# EAGLE schematic 417-300-001B Main Power Enclosure (EAGLE 6.5.0)

## Sheet 1 of 3
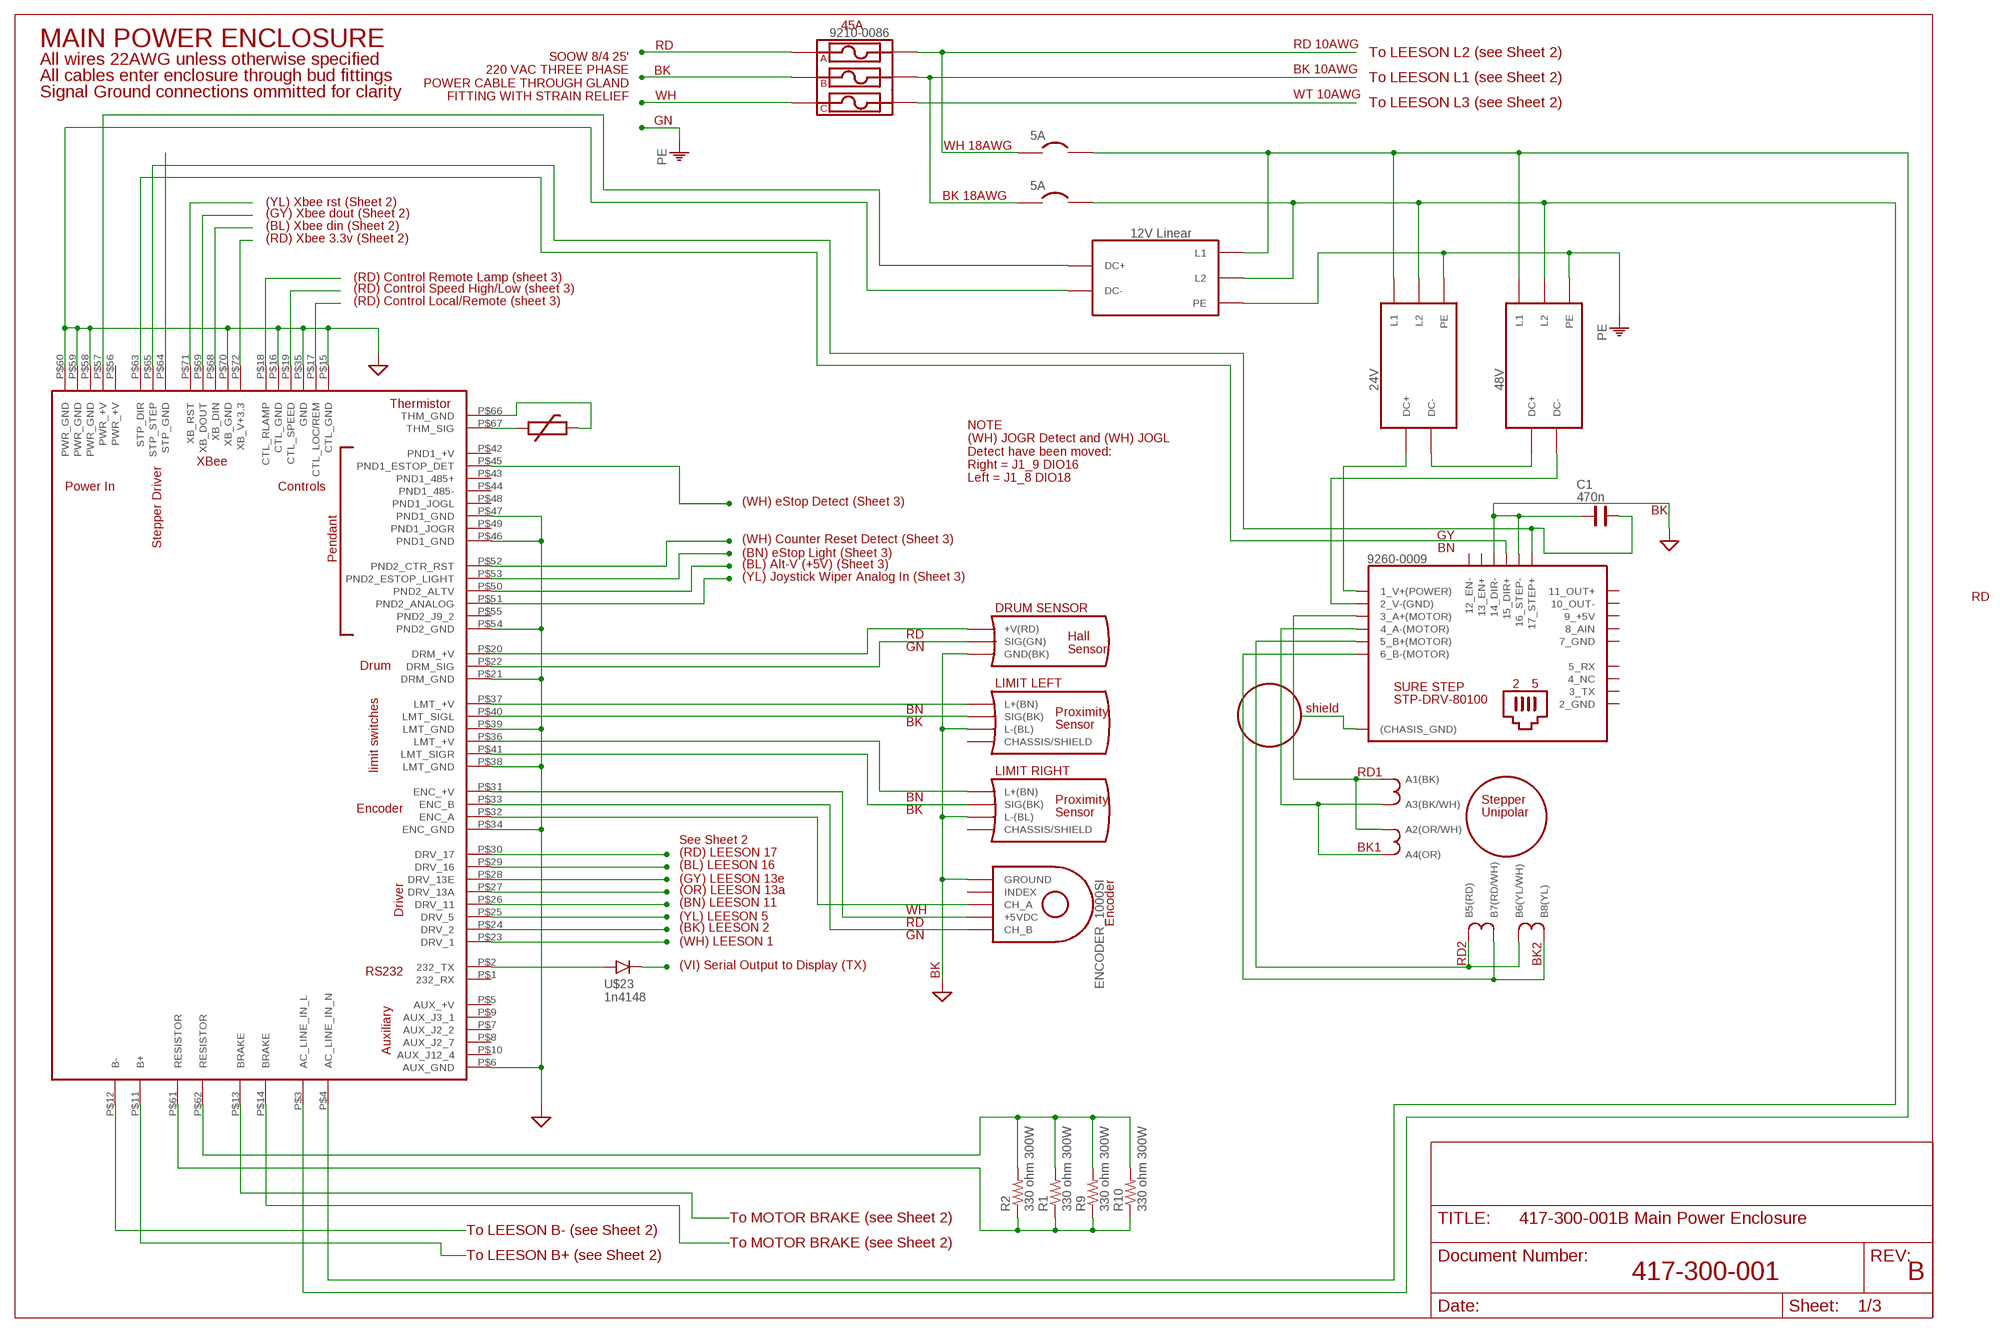
[diagram p0: schematic, sheet 1]

### Parts
C1  470n  C0805  [C0805]
PE3  GND_SIGNAL  [BOGUS]
PE4  GND_SIGNAL  [BOGUS]
PE9  GND_SIGNAL  [BOGUS]
PE10  GND_SIGNAL  [BOGUS]
R1  330 ohm 300W  RESISTORKIT  [AXIAL-0.3-KIT]
R2  330 ohm 300W  RESISTORKIT  [AXIAL-0.3-KIT]
R9  330 ohm 300W  RESISTORKIT  [AXIAL-0.3-KIT]
R10  330 ohm 300W  RESISTORKIT  [AXIAL-0.3-KIT]
U$1  SOSI_CONTROLLER_ECO_0.3  [BOGUS]
U$2  THERMISTOR  [BOGUS]
U$3  SENSOR_HALL  [BOGUS@1]
U$4  ENCODER_1000SI  [BOGUS]
U$6  SENSOR_PROXIMITY  [BOGUS]
U$7  5A  CIRCUIT_BREAKER  [BOGUS]
U$8  5A  CIRCUIT_BREAKER  [BOGUS]
U$9  SENSOR_PROXIMITY  [BOGUS]
U$10  24V  POWER_SUPPLY  [BOGUS]
U$11  FUSE_HOLDER_3-POLE  [BOGUS]
U$12  48V  POWER_SUPPLY  [BOGUS]
U$13  MOTOR_STEPPER_UNIPOLAR  [BOGUS]
U$14  SURE_STEP_STP-DRV-80100  [BOGUS]
U$18  12V Linear  POWER_SUPPLY  [BOGUS]
U$23  1n4148  DIODE_RS1M  [DO214AC]

### Nets
N$1: U$7.P$1 U$11.P$3
N$2: U$1.P$12(B-)
N$3: U$11.P$2
N$4: U$11.P$1
N$5: U$1.P$11(B+)
N$6: U$1.P$13(BRAKE)
N$7: U$1.P$14(BRAKE)
N$8: R1.P$1 R2.P$1 R9.P$1 R10.P$1 U$1.P$61(RESISTOR)
N$9: U$11.P$6
N$10: U$8.P$1 U$11.P$4
N$11: U$1.P$3(AC_LINE_IN_L) U$7.P$2 U$10.P$3(L1) U$12.P$3(L1) U$18.P$3(L1)
N$12: R1.P$2 R2.P$2 R9.P$2 R10.P$2 U$1.P$62(RESISTOR)
N$13: U$1.P$71(XB_RST)
N$14: U$1.P$69(XB_DOUT)
N$15: U$10.P$1(DC+) U$14.P$2(1_V+(POWER))
N$16: U$12.P$2(DC-) U$14.P$3(2_V-(GND))
N$17: U$13.P$1(A1(BK)) U$13.P$2(A2(OR/WH)) U$14.P$4(3_A+(MOTOR))
N$18: U$1.P$4(AC_LINE_IN_N) U$8.P$2 U$10.P$4(L2) U$12.P$4(L2) U$18.P$4(L2)
N$19: U$10.P$2(DC-) U$12.P$1(DC+)
N$20: U$1.P$51(PND2_ANALOG)
N$21: U$1.P$57(PWR_+V) U$18.P$1(DC+)
N$22: U$1.P$41(LMT_SIGR) U$9.P$4(SIG(BK))
N$23: U$1.P$67(THM_SIG) U$2.P$1
N$24: U$13.P$3(A3(BK/WH)) U$13.P$4(A4(OR)) U$14.P$5(4_A-(MOTOR))
N$25: U$1.P$66(THM_GND) U$2.P$2
N$26: U$14.P$1((CHASIS_GND))
N$27: U$1.P$68(XB_DIN)
N$28: U$13.P$5(B5(RD)) U$13.P$6(B6(YL/WH)) U$14.P$6(5_B+(MOTOR))
N$29: U$13.P$7(B7(RD/WH)) U$13.P$8(B8(YL)) U$14.P$7(6_B-(MOTOR))
N$30: U$1.P$36(LMT_+V) U$9.P$2(L+(BN))
N$31: U$1.P$30(DRV_17)
N$32: C1.2 U$1.P$65(STP_STEP) U$14.P$18(17_STEP+)
N$33: U$1.P$63(STP_DIR) U$14.P$16(15_DIR+)
N$34: U$1.P$72(XB_V+3.3)
N$35: U$1.P$18(CTL_RLAMP)
N$36: U$1.P$27(DRV_13A)
N$37: U$1.P$19(CTL_SPEED)
N$38: U$1.P$26(DRV_11)
N$40: U$1.P$17(CTL_LOC/REM)
N$41: U$1.P$25(DRV_5)
N$42: U$1.P$64(STP_GND)
N$43: U$1.P$24(DRV_2)
N$51: U$1.P$52(PND2_CTR_RST)
N$52: U$1.P$53(PND2_ESTOP_LIGHT)
N$53: U$11.P$5
N$54: U$1.P$23(DRV_1)
N$55: U$1.P$28(DRV_13E)
N$56: U$1.P$29(DRV_16)
N$57: U$1.P$32(ENC_A) U$4.P$2(CH_A)
N$58: U$3.P$2(GND(BK)) U$4.P$4(GROUND) U$6.P$3(L-(BL)) U$9.P$3(L-(BL))
N$59: U$1.P$33(ENC_B) U$4.P$3(CH_B)
N$60: U$1.P$31(ENC_+V) U$4.P$1(+5VDC)
N$61: U$1.P$37(LMT_+V) U$6.P$2(L+(BN))
N$62: U$1.P$50(PND2_ALTV)
N$63: U$1.P$40(LMT_SIGL) U$6.P$4(SIG(BK))
N$64: U$1.P$22(DRM_SIG) U$3.P$3(SIG(GN))
N$65: U$1.P$20(DRM_+V) U$3.P$1(+V(RD))
N$66: U$1.P$45(PND1_ESTOP_DET)
N$104: U$23.C
PE: C1.1 PE3.P$1(PE) PE4.P$1(PE) PE9.P$1(PE) U$1.P$6(AUX_GND) U$1.P$15(CTL_GND) U$1.P$16(CTL_GND) U$1.P$21(DRM_GND) U$1.P$34(ENC_GND) U$1.P$35(GND) U$1.P$38(LMT_GND) U$1.P$39(LMT_GND) U$1.P$46(PND1_GND) U$1.P$47(PND1_GND) U$1.P$54(PND2_GND) U$1.P$58(PWR_GND) U$1.P$59(PWR_GND) U$1.P$60(PWR_GND) U$1.P$70(XB_GND) U$10.P$5(PE) U$12.P$5(PE) U$14.P$15(14_DIR-) U$14.P$17(16_STEP-) U$18.P$2(DC-) U$18.P$5(PE) ; also sheet 2,3
Unconnected: PE10.P$1(PE) U$1.P$1(232_RX) U$1.P$2(232_TX) U$1.P$5(AUX_+V) U$1.P$7(AUX_J2_2) U$1.P$8(AUX_J2_7) U$1.P$9(AUX_J3_1) U$1.P$10(AUX_J12_4) U$1.P$42(PND1_+V) U$1.P$43(PND1_485+) U$1.P$44(PND1_485-) U$1.P$48(PND1_JOGL) U$1.P$49(PND1_JOGR) U$1.P$55(PND2_J9_2) U$1.P$56(PWR_+V) U$4.P$5(INDEX) U$6.P$1(CHASSIS/SHIELD) U$9.P$1(CHASSIS/SHIELD) U$23.A

### Notes on the sheet
- 45A
- MAIN POWER ENCLOSURE | RD | RD 10AWG
- SOOW 8/4 25'
  220 VAC THREE PHASE
  POWER CABLE THROUGH GLAND
  FITTING WITH STRAIN RELIEF
- To LEESON L2 (see Sheet 2)
- All wires 22AWG unless otherwise specified
- BK | BK 10AWG
- All cables enter enclosure through bud fittings | To LEESON L1 (see Sheet 2)
- Signal Ground connections ommitted for clarity | WH | WT 10AWG
- To LEESON L3 (see Sheet 2)
- GN
- WH 18AWG
- BK 18AWG
- (YL) Xbee rst (Sheet 2)
- (GY) Xbee dout (Sheet 2)
- (BL) Xbee din (Sheet 2)
- (RD) Xbee 3.3v (Sheet 2)
- (RD) Control Remote Lamp (sheet 3)
- (RD) Control Speed High/Low (sheet 3)
- (RD) Control Local/Remote (sheet 3)
- NOTE
  (WH) JOGR Detect and (WH) JOGL 
  Detect have been moved:
  Right = J1_9 DIO16
  Left = J1_8 DIO18
- (WH) eStop Detect (Sheet 3) | BK
- GY
- (WH) Counter Reset Detect (Sheet 3) | BN
- (BN) eStop Light (Sheet 3)
- (BL) Alt-V (+5V) (Sheet 3)
- (YL) Joystick Wiper Analog In (Sheet 3)
- RD
- DRUM SENSOR
- RD
- GN
- LIMIT LEFT
- BN | shield
- BK
- LIMIT RIGHT | RD1
- BN
- BK
- See Sheet 2
- BK1
- (RD) LEESON 17
- (BL) LEESON 16
- (GY) LEESON 13e
- (OR) LEESON 13a
- (BN) LEESON 11
- WH
- (YL) LEESON 5
- RD
- (BK) LEESON 2
- GN
- (WH) LEESON 1
- RD2 | BK2
- (VI) Serial Output to Display (TX)
- BK
- To MOTOR BRAKE (see Sheet 2)
- To LEESON B- (see Sheet 2)
- To MOTOR BRAKE (see Sheet 2)
- To LEESON B+ (see Sheet 2)
- 417-300-001 | B

## Sheet 2 of 3
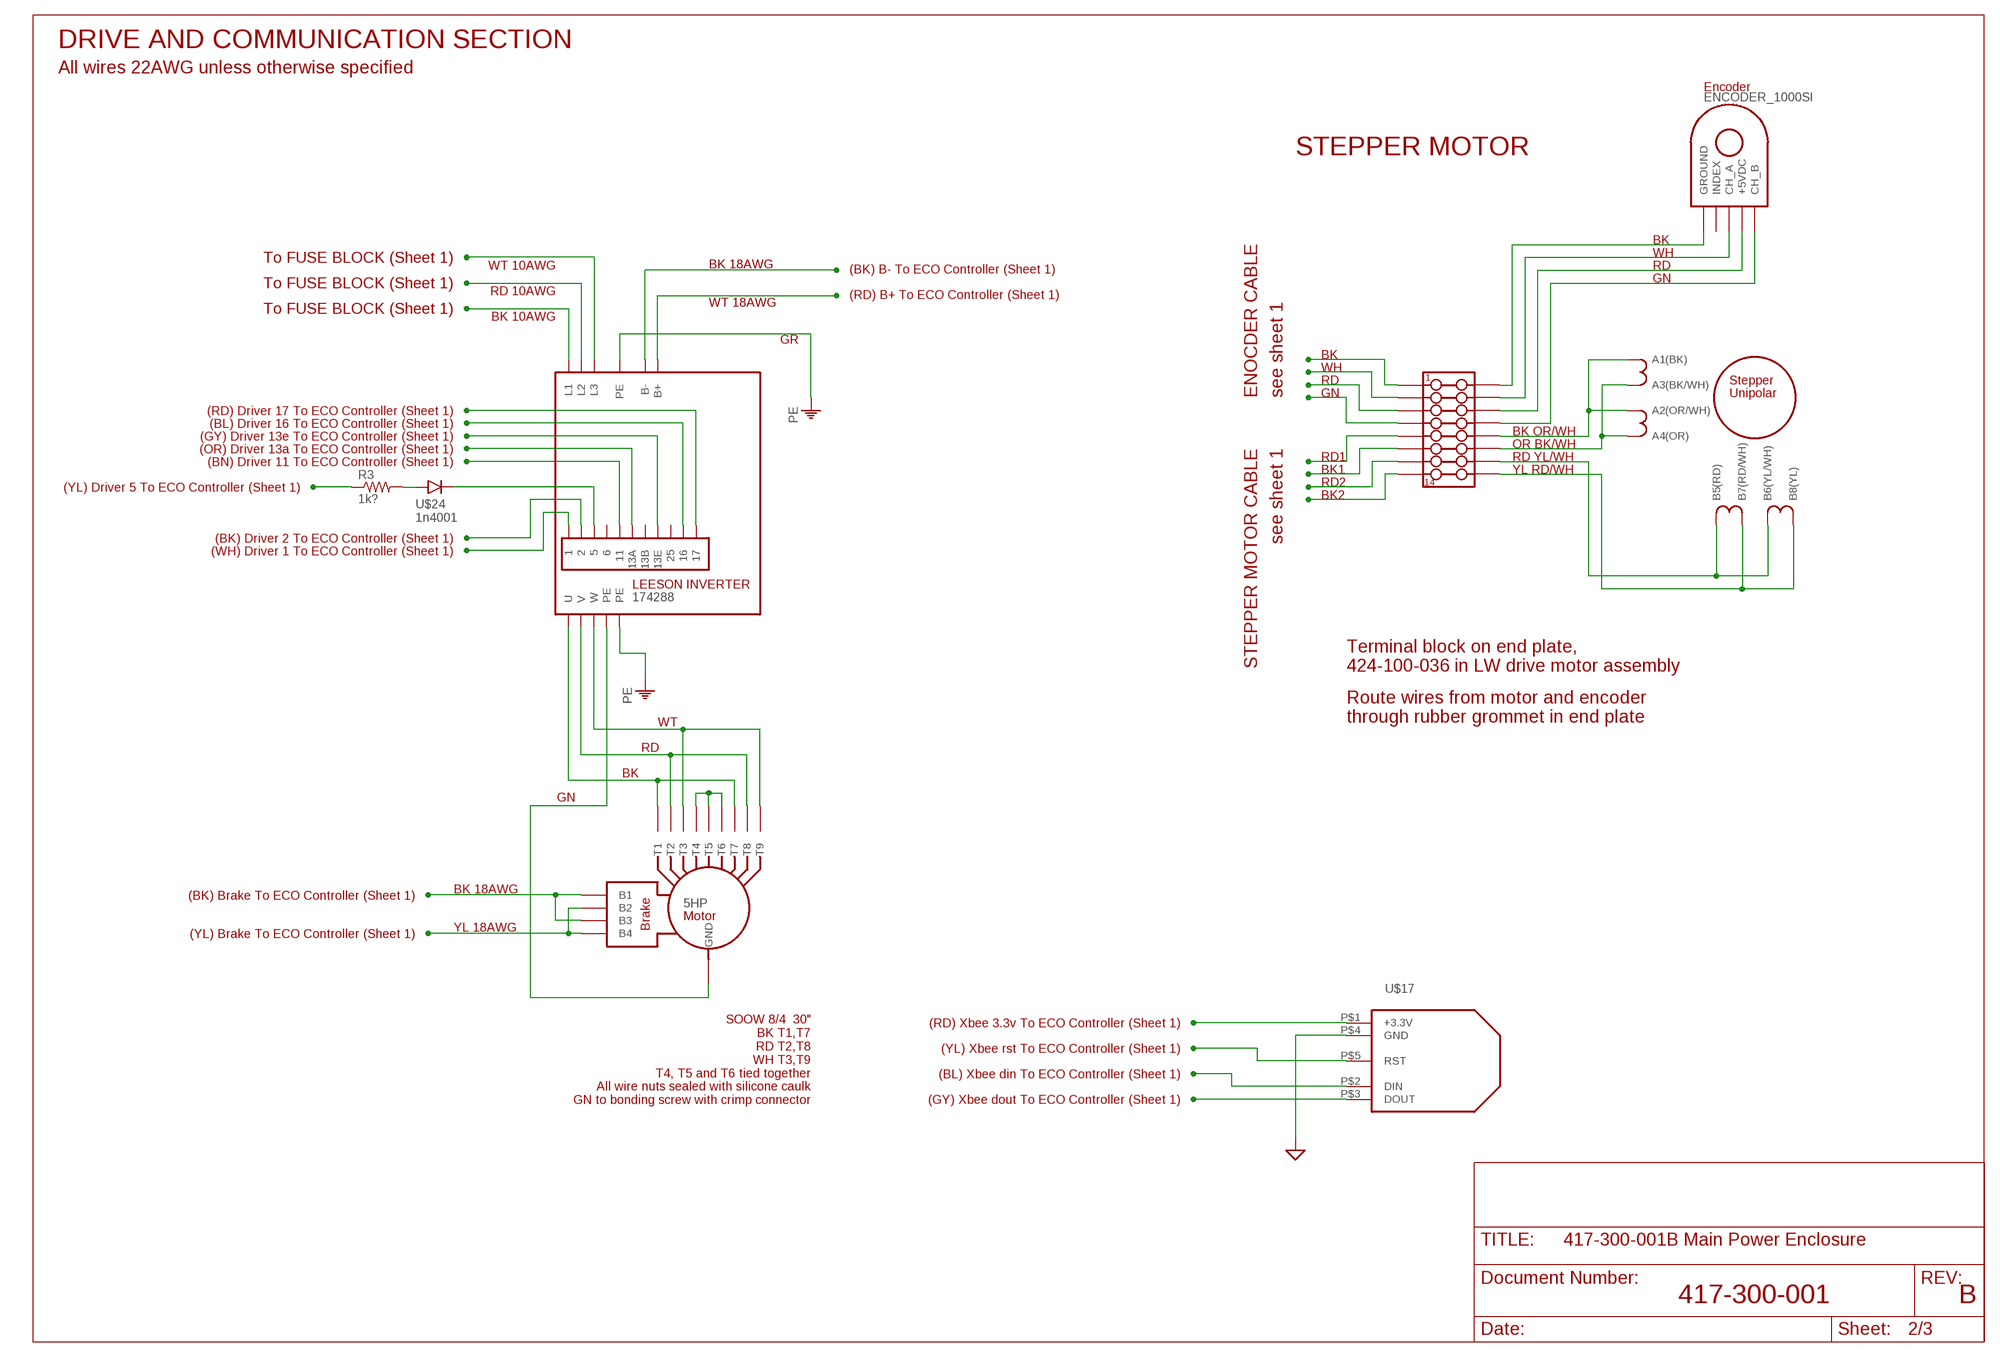
[diagram p1: schematic, sheet 2]

### Parts
PE12  GND_SIGNAL  [BOGUS]
R3  1k?  RESISTOR0805-RES  [0805]
U$17  MODULE_XBEE  [BOGUS]
U$19  5HP  MOTOR_3PH  [BOGUS]
U$20  TERMINAL_BLOCK_8  [BOGUS]
U$21  MOTOR_STEPPER_UNIPOLAR  [BOGUS]
U$22  ENCODER_1000SI  [BOGUS]
U$24  1n4001  DIODE_RS1M  [DO214AC]
U$27  174288  INVERTER_LEESON_3-PHASE  [BOGUS@2]

### Nets
N$39: U$27.P$14(L1)
N$45: U$27.P$1
N$46: U$27.P$2
N$48: U$27.P$15(L2)
N$49: U$27.P$3
N$67: U$27.P$5
N$68: U$27.P$6(13A)
N$69: U$27.P$8(13E)
N$70: U$27.P$9
N$71: U$27.P$10
N$75: U$27.P$16(L3)
N$77: U$17.P$3(DOUT)
N$78: U$17.P$2(DIN)
N$79: U$17.P$5(RST)
N$80: U$17.P$1(+3.3V)
N$81: U$20.P$12 U$21.P$1(A1(BK)) U$21.P$2(A2(OR/WH))
N$82: U$19.P$8(T4) U$19.P$9(T5) U$19.P$10(T6)
N$83: U$19.P$5(T1) U$19.P$11(T7) U$27.P$20(U)
N$84: U$19.P$6(T2) U$19.P$12(T8) U$27.P$21(V)
N$85: U$19.P$7(T3) U$19.P$13(T9) U$27.P$22(W)
N$86: U$19.P$14(GND) U$27.P$18(PE)
N$87: U$19.P$2(B2) U$19.P$4(B4)
N$88: U$20.P$11 U$21.P$3(A3(BK/WH)) U$21.P$4(A4(OR))
N$89: U$20.P$9 U$21.P$7(B7(RD/WH)) U$21.P$8(B8(YL))
N$90: U$19.P$1(B1) U$19.P$3(B3)
N$91: U$20.P$10 U$21.P$5(B5(RD)) U$21.P$6(B6(YL/WH))
N$92: U$20.P$16 U$22.P$4(GROUND)
N$93: U$20.P$15 U$22.P$2(CH_A)
N$94: U$20.P$14 U$22.P$1(+5VDC)
N$95: U$20.P$13 U$22.P$3(CH_B)
N$96: U$20.P$1
N$97: U$20.P$2
N$98: U$20.P$3
N$99: U$20.P$4
N$100: U$20.P$8
N$101: U$20.P$7
N$102: U$20.P$6
N$103: U$20.P$5
N$105: R3.2 U$24.A
N$106: R3.1
N$121: U$27.P$13(B-)
N$122: U$27.P$12(B+)
PE: PE12.P$1(PE) U$17.P$4(GND) U$27.P$17(PE) U$27.P$19(PE) ; also sheet 1,3
Unconnected: U$22.P$5(INDEX) U$24.C U$27.P$4 U$27.P$7(13B) U$27.P$11

### Notes on the sheet
- DRIVE AND COMMUNICATION SECTION
- All wires 22AWG unless otherwise specified
- STEPPER MOTOR
- BK
- To FUSE BLOCK (Sheet 1)
- WH
- WT 10AWG
- BK 18AWG | RD
- (BK) B- To ECO Controller (Sheet 1)
- To FUSE BLOCK (Sheet 1)
- GN
- RD 10AWG
- (RD) B+ To ECO Controller (Sheet 1)
- To FUSE BLOCK (Sheet 1)
- WT 18AWG
- BK 10AWG
- GR
- BK
- WH
- RD
- ENOCDER CABLE | see sheet 1 | GN
- (RD) Driver 17 To ECO Controller (Sheet 1)
- (BL) Driver 16 To ECO Controller (Sheet 1)
- (GY) Driver 13e To ECO Controller (Sheet 1)
- BK OR/WH
- (OR) Driver 13a To ECO Controller (Sheet 1)
- STEPPER MOTOR CABLE | see sheet 1 | OR BK/WH
- (BN) Driver 11 To ECO Controller (Sheet 1)
- RD1 | RD YL/WH
- BK1 | YL RD/WH
- (YL) Driver 5 To ECO Controller (Sheet 1)
- RD2
- BK2
- (BK) Driver 2 To ECO Controller (Sheet 1)
- (WH) Driver 1 To ECO Controller (Sheet 1)
- Terminal block on end plate,
- 424-100-036 in LW drive motor assembly
- Route wires from motor and encoder
- through rubber grommet in end plate
- WT
- RD
- BK
- GN
- (BK) Brake To ECO Controller (Sheet 1) | BK 18AWG
- (YL) Brake To ECO Controller (Sheet 1) | YL 18AWG
- SOOW 8/4  30"
  BK T1,T7
  RD T2,T8
  WH T3,T9
  T4, T5 and T6 tied together
  All wire nuts sealed with silicone caulk
  GN to bonding screw with crimp connector
- (RD) Xbee 3.3v To ECO Controller (Sheet 1)
- (YL) Xbee rst To ECO Controller (Sheet 1)
- (BL) Xbee din To ECO Controller (Sheet 1)
- (GY) Xbee dout To ECO Controller (Sheet 1)
- 417-300-001 | B

## Sheet 3 of 3
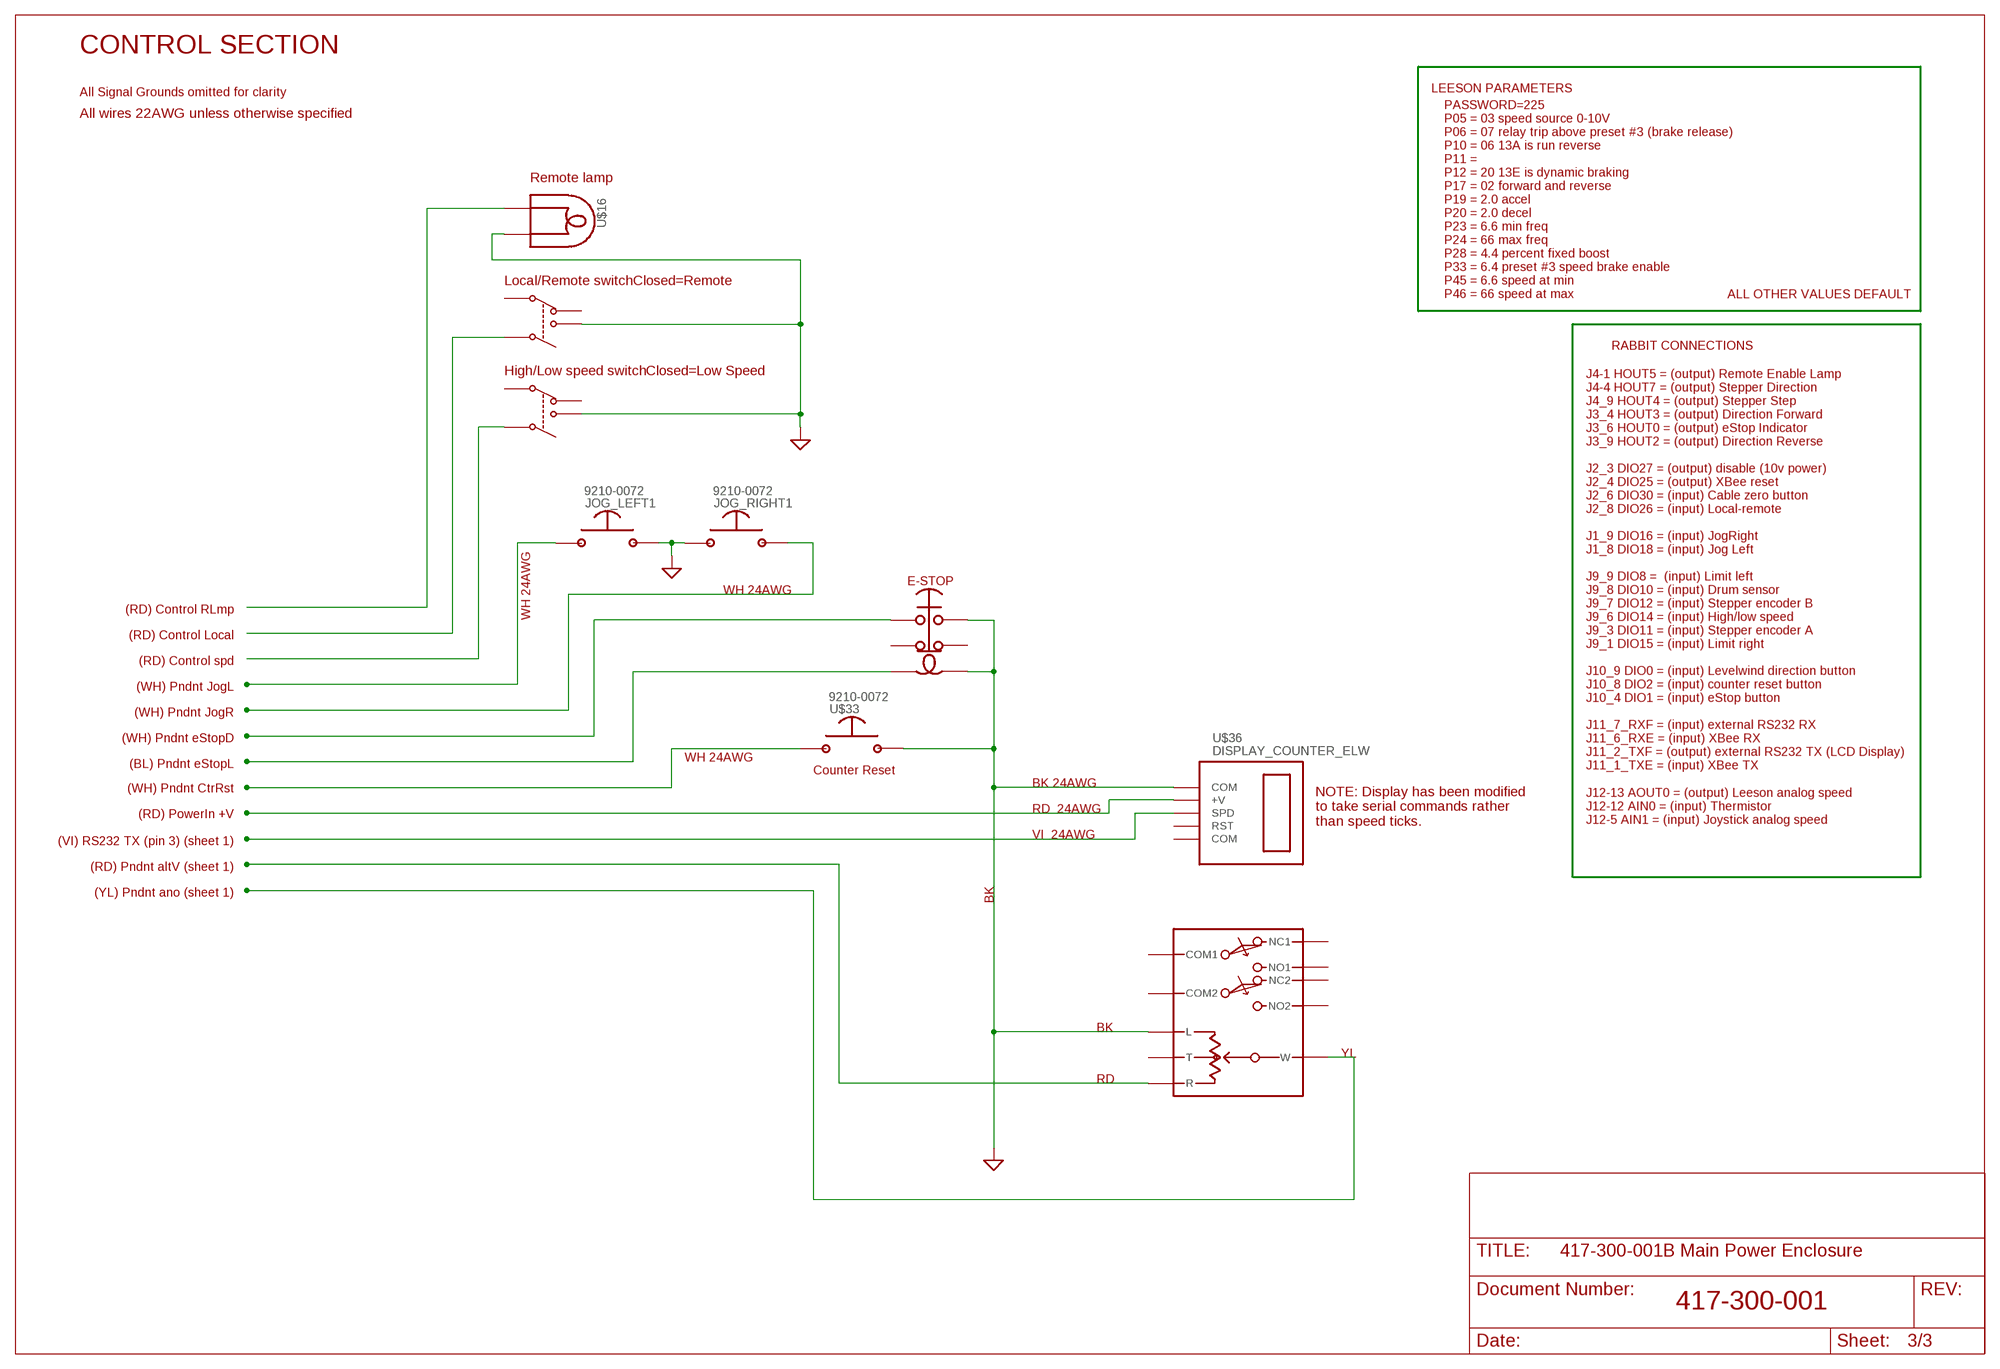
[diagram p2: schematic, sheet 3]

### Parts
JOG_LEFT1  Counter Reset  SWITCH_MOM_NO  [BOGUS]
JOG_RIGHT1  Counter Reset  SWITCH_MOM_NO  [BOGUS]
PE6  GND_SIGNAL  [BOGUS]
PE8  GND_SIGNAL  [BOGUS]
PE11  GND_SIGNAL  [BOGUS]
U$5  SWITCH_DPST_NONC  [BOGUS]
U$15  SWITCH_DPST_NONC  [BOGUS]
U$16  INDICATOR_LIGHT  [BOGUS]
U$33  Counter Reset  SWITCH_MOM_NO  [BOGUS]
U$34  SWITCH_ESTOP_LIGHTED  [BOGUS]
U$35  JOYSTICK_PRO-5  [BOGUS]
U$36  DISPLAY_COUNTER_ELW  [BOGUS]

### Nets
N$72: U$35.P$8(R)
N$73: U$15.P$3
N$74: U$5.P$3
N$76: U$16.P$1
N$143: U$35.P$10(W)
N$145: U$36.P$1(+V)
N$146: U$36.P$5(SPD)
N$147: U$33.P$1
N$148: U$34.P$1
N$151: U$34.P$5
N$152: JOG_RIGHT1.P$2
N$154: JOG_LEFT1.P$1
PE: JOG_LEFT1.P$2 JOG_RIGHT1.P$1 PE6.P$1(PE) PE8.P$1(PE) PE11.P$1(PE) U$5.P$4 U$15.P$4 U$16.P$2 U$33.P$2 U$34.P$3 U$34.P$6 U$35.P$3(L) U$36.P$2(COM) ; also sheet 1,2
Unconnected: U$5.P$1 U$5.P$2 U$15.P$1 U$15.P$2 U$34.P$2 U$34.P$4 U$35.P$1(COM1) U$35.P$2(COM2) U$35.P$4(NC1) U$35.P$5(NC2) U$35.P$6(NO1) U$35.P$7(NO2) U$35.P$9(T) U$36.P$3(COM) U$36.P$4(RST)

### Notes on the sheet
- CONTROL SECTION
- LEESON PARAMETERS
- All Signal Grounds omitted for clarity
- All wires 22AWG unless otherwise specified
- Remote lamp
- Local/Remote switch | Closed=Remote
- PASSWORD=225
  P05 = 03 speed source 0-10V
  P06 = 07 relay trip above preset #3 (brake release)
  P10 = 06 13A is run reverse
  P11 =
  P12 = 20 13E is dynamic braking
  P17 = 02 forward and reverse
  P19 = 2.0 accel
  P20 = 2.0 decel
  P23 = 6.6 min freq
  P24 = 66 max freq
  P28 = 4.4 percent fixed boost
  P33 = 6.4 preset #3 speed brake enable
  P45 = 6.6 speed at min
  P46 = 66 speed at max
- ALL OTHER VALUES DEFAULT
- RABBIT CONNECTIONS
- High/Low speed switch | Closed=Low Speed
- WH 24AWG
- (RD) Control RLmp
- WH 24AWG
- (RD) Control Local
- (RD) Control spd
- (WH) Pndnt JogL
- (WH) Pndnt JogR
- (WH) Pndnt eStopD
- (BL) Pndnt eStopL | WH 24AWG
- Counter Reset
- (WH) Pndnt CtrRst
- BK 24AWG
- (RD) PowerIn +V
- RD  24AWG
- NOTE: Display has been modified 
  to take serial commands rather 
  than speed ticks.
- (VI) RS232 TX (pin 3) (sheet 1) | VI  24AWG
- (RD) Pndnt altV (sheet 1)
- J4-1 HOUT5 = (output) Remote Enable Lamp
  J4-4 HOUT7 = (output) Stepper Direction
  J4_9 HOUT4 = (output) Stepper Step
  J3_4 HOUT3 = (output) Direction Forward
  J3_6 HOUT0 = (output) eStop Indicator
  J3_9 HOUT2 = (output) Direction Reverse
  
  J2_3 DIO27 = (output) disable (10v power)
  J2_4 DIO25 = (output) XBee reset
  J2_6 DIO30 = (input) Cable zero button
  J2_8 DIO26 = (input) Local-remote
  
  J1_9 DIO16 = (input) JogRight
  J1_8 DIO18 = (input) Jog Left
  
  J9_9 DIO8 =  (input) Limit left
  J9_8 DIO10 = (input) Drum sensor
  J9_7 DIO12 = (input) Stepper encoder B
  J9_6 DIO14 = (input) High/low speed
  J9_3 DIO11 = (input) Stepper encoder A 
  J9_1 DIO15 = (input) Limit right
  
  J10_9 DIO0 = (input) Levelwind direction button
  J10_8 DIO2 = (input) counter reset button 
  J10_4 DIO1 = (input) eStop button 
  
  J11_7_RXF = (input) external RS232 RX
  J11_6_RXE = (input) XBee RX
  J11_2_TXF = (output) external RS232 TX (LCD Display)
  J11_1_TXE = (input) XBee TX
  
  J12-13 AOUT0 = (output) Leeson analog speed
  J12-12 AIN0 = (input) Thermistor
  J12-5 AIN1 = (input) Joystick analog speed
- (YL) Pndnt ano (sheet 1)
- BK
- BK
- YL
- RD
- 417-300-001

## Power pins joined to a net without a drawn wire
2_GND: U$14.P$19(2_GND)
3_TX: U$14.P$20(3_TX)
4_NC: U$14.P$21(4_NC)
5_RX: U$14.P$22(5_RX)
7_GND: U$14.P$8(7_GND)
8_AIN: U$14.P$9(8_AIN)
9_+5V: U$14.P$10(9_+5V)
10_OUT-: U$14.P$11(10_OUT-)
11_OUT+: U$14.P$12(11_OUT+)
12_EN-: U$14.P$13(12_EN-)
13_EN+: U$14.P$14(13_EN+)

## Library data of the parts
C1 = DougM-SOSI-ResCap:C0805: chicklet part - capacitor 0805
JOG_LEFT1 JOG_RIGHT1 U$33 = DougM-SOSI-Wiring-Diagram:SWITCH_MOM_NO: 9210-0072 Mouser Part #: 850-59-313 Manufacturer Part #: 59-313
PE3 PE4 PE6 PE8-PE12 = DougM-SOSI-Wiring-Diagram.rpt:GND_SIGNAL: SUPPLY SYMBOL
R1-R3 R9 R10 = DougM-SOSI-ResCap:RESISTOR: Resistor Basic schematic elements and footprints for 0603, 1206, and PTH resistors.
U$1 = DougM-SOSI-Wiring-Diagram.rpt:SOSI_CONTROLLER_ECO_0.3: 418-300-004 ECO Controller 0.3 Sound Ocean Systems 418-300-004 Sound Ocean Systems 418-300-004
U$2 = DougM-SOSI-Wiring-Diagram.rpt:THERMISTOR: (no PN available) (no description available) Soundnine Inc. (no vendor PN available)
U$3 = DougM-SOSI-Wiring-Diagram.rpt:SENSOR_HALL
U$4 = DougM-SOSI-Wiring-Diagram.rpt:ENCODER_1000SI: (no PN) 1000SI Single-Ended Encoder with Index Channel (comes as part of Stepper Motor assembly 9500-0016) Anaheim Automation
U$5 U$15 = DougM-SOSI-Wiring-Diagram.rpt:SWITCH_DPST_NONC: Allen Bradley 800H HR2
U$6 U$9 = DougM-SOSI-Wiring-Diagram.rpt:SENSOR_PROXIMITY: 9210-0023 Proximity Sensor, Inductive, 5mm Dia., 10-30 VDC, 3-wire, NPN, Shielded, 1.5mm nominal sensing distance, N.O., 2-meter cable 9210-0088 Proximity Sensor, Inductive, 12mm Dia., 10-30 VDC, 3-wire, unshielded, 8mm nominal sensing distance, N.O., 2-meter cable 9210-0191 Proximity Sensor, Inductive, 8mm Dia., extended range, 10-30 VDC, 3-wire, NPN, N.O., 4mm nominal sensing distance, unshielded 2-meter cable 9210-0284 Sensor, Proximity, Inductive, 18mm Dia., Extended Range, 10-30 VDC, 3 Wire, NPN, shielded, 2-Meter Cable Manufacturer Automation Direct
U$7 U$8 = DougM-SOSI-Wiring-Diagram.rpt:CIRCUIT_BREAKER: 9210-0169 Circuit Breaker, 5A, 2 Pole, UL 489 Rated, DIN Rail Mount 9210-0196 Circuit Breaker, Motor Protection, 40-63A Capacity, 480VAC, 60Hz, DIN Rail Mount
U$10 U$12 U$18 = DougM-SOSI-Wiring-Diagram.rpt:POWER_SUPPLY: 9210-0283 VGD-60-D524 Power Supply, VGD Series, AC/DC Convert Dual, 5/24V 60W, ENC 9260-0010 HRPG-200-48 Power Supply, 48VDC, 200W Single Output w/ PFC Function 9260-0011 USP-500-48 48VDC 500 Watt Power Supply 9260-0019 HC24-2.4-AG Linear Power Supply, 24V, 2.4A Output 9260-0020 HRPG-200-24 Power Supply, Linear & Switching, 24VDC, 201.6W, 8.4A, w/ PFC 9350-0002 UTC-3124 Signal Conditioner and Power Supply
U$11 = DougM-SOSI-Wiring-Diagram.rpt:FUSE_HOLDER_3-POLE: 9210-0086 BC6033PQ Fuseholder, Class CC & Class G, 3 pole, 600V, 30A, for 13/32x1 1/2 fuses Cooper/Bussman North Coast Electric
U$13 = DougM-SOSI-Wiring-Diagram.rpt:MOTOR_STEPPER_UNIPOLAR: 9500-0016 34Y214D-LW8-1000SI Stepper Motor with 1000 line encoder Anaheim Automation Kaman Industrial Technologies
U$14 = DougM-SOSI-Wiring-Diagram.rpt:SURE_STEP_STP-DRV-80100: 9260-0009 STP-DRV-80100 Step Motor Driver, 80 V 10A Sure Step Automation Direct
U$16 = DougM-SOSI-Wiring-Diagram.rpt:INDICATOR_LIGHT: 9210-0341 OMPBD7D-P3N3 Indicator Light, LED, Complete Asssembly, 22.5mm, IP66, 24V AC/DC Omega www.omega.com
U$17 = DougM-SOSI-Wiring-Diagram.rpt:MODULE_XBEE: 9210-0526 MODULE XBEE PRO ZNET 2.5 W/RPSMA Digi International/Maxstream XBP24-BSIT-004 Digi-Key XBP24-BSIT-004-ND 9210-0703 MODULE 802.15.4 63MW WIRE ANT Digi International/Maxstream XBP24-AWI-001 Digi-Key XBP24-AWI-001-ND
U$19 = DougM-SOSI-Wiring-Diagram:MOTOR_3PH: 9500-0000 113020 Electric motor, washdown, 1HP, 208-230/460VAC, 3 phase, 1725 RPM, 56C mounting 9500-0005 G120762 Electric Motor, Washdown, 2HP, 208-230/460V, 60Hz, Cont., 1800 RPM, TEFC, 145TC 9500-0007 CEWDBM3611T BrakeMotor, Electric, Washdown, 3HP, 208-230/460V, 1760RPM, 3 Ph., 60Hz, 182TC, TEFC 9500-0009 G140467.00 Electric Motor, Washdown, 7.5HP, 220 VAC, 50-60 Hz, 3 Phase, 213TC Frame, No Base Leeson Kaman Industrial Technologies McGuire Bearing
U$20 = DougM-SOSI-Wiring-Diagram:TERMINAL_BLOCK_8: 9210-0073 ESO800/08DSFB CONN TERMINAL STRIP 8MM 8CIRC On Shore Technology Inc Digi-Key ED2999-ND
U$21 = DougM-SOSI-Wiring-Diagram:MOTOR_STEPPER_UNIPOLAR: 9500-0016 34Y214D-LW8-1000SI Stepper Motor with 1000 line encoder Anaheim Automation Kaman Industrial Technologies
U$22 = DougM-SOSI-Wiring-Diagram:ENCODER_1000SI: (no PN) 1000SI Single-Ended Encoder with Index Channel (comes as part of Stepper Motor assembly 9500-0016) Anaheim Automation
U$23 U$24 = DougM-SOSI-crystal-diode:DIODE_RS1M: 9210-0534 DIODE GP FAST 1A 1000V SMA Fairchild Semiconductor RS1M Digi-Key RS1MFSCT-ND
U$27 = DougM-SOSI-Wiring-Diagram.rpt:INVERTER_LEESON_3-PHASE: 9260-0001 174265 Motor control, adjustable speed, 1HP, 110VAC single phase input, 220VAC 3 phase output 9260-0002 174270 Motor control, adjustable speed, 1HP, 220VAC single phase input, 220VAC 3 phase output 9260-0006 174278 Inverter, SM Series, 2HP, 208/240 VAC, 3-Phase 9260-0007 174279 Inverter, SM Series, 3HP, 208/240 VAC, 3-Phase 9260-0008 174280 Inverter, SM Series, 7.5HP, 208/240 VAC, 3-Phase 9260-0016 174432 Inverter, SM Series, 20HP, 400-480V, 3-Phase 9260-0017 174282 Inverter, SM Series, 1HP, 400-480V, 3-Phase 9260-0021 174273 Inverter, SM Series, 3HP, 208/240 VAC, 1 phase 9260-0022 174272 Inverter, SM Series, 2HP, 208/240 VAC, 1 phase Leeson Allied Electronics McGuire Bearing
U$34 = DougM-SOSI-Wiring-Diagram:SWITCH_ESTOP_LIGHTED: 9210-0045 Switch, Emergency Stop, w/ #800T-XA4 contact block (old #800H-FRXTQH10RA4) Allen Bradley 800H-FRXTQH2RA4
U$35 = DougM-SOSI-Wiring-Diagram:JOYSTICK_PRO-5: 9280-0000 PRO5-202.1085 (w/20k center tap potentiometer) Joystick (Master Switch), w/20k center tap potentiometer J. R. Merritt Controls
U$36 = DougM-SOSI-Wiring-Diagram:DISPLAY_COUNTER_ELW: 9215-0003 12062A-1 Display Board Assy., ECO-ELW line speed/counter Soundnine Inc.